# Altium schematic sheet Э4_1_New.SchDoc: Оконечное устройство
size 420 x 297 mm; ApprovedBy: Алексеев; CheckedBy: Богданов; Author: Пятиренко; DocumentNumber: АЕСН.464512.002Э4; SheetNumber: 1; SheetTotal: 2; Title2: Схема электрических соединений; PERVICH PRIM: АЕСН.464512.002; Application_BuildNumber: sdfsdfsdfsdfsdfs
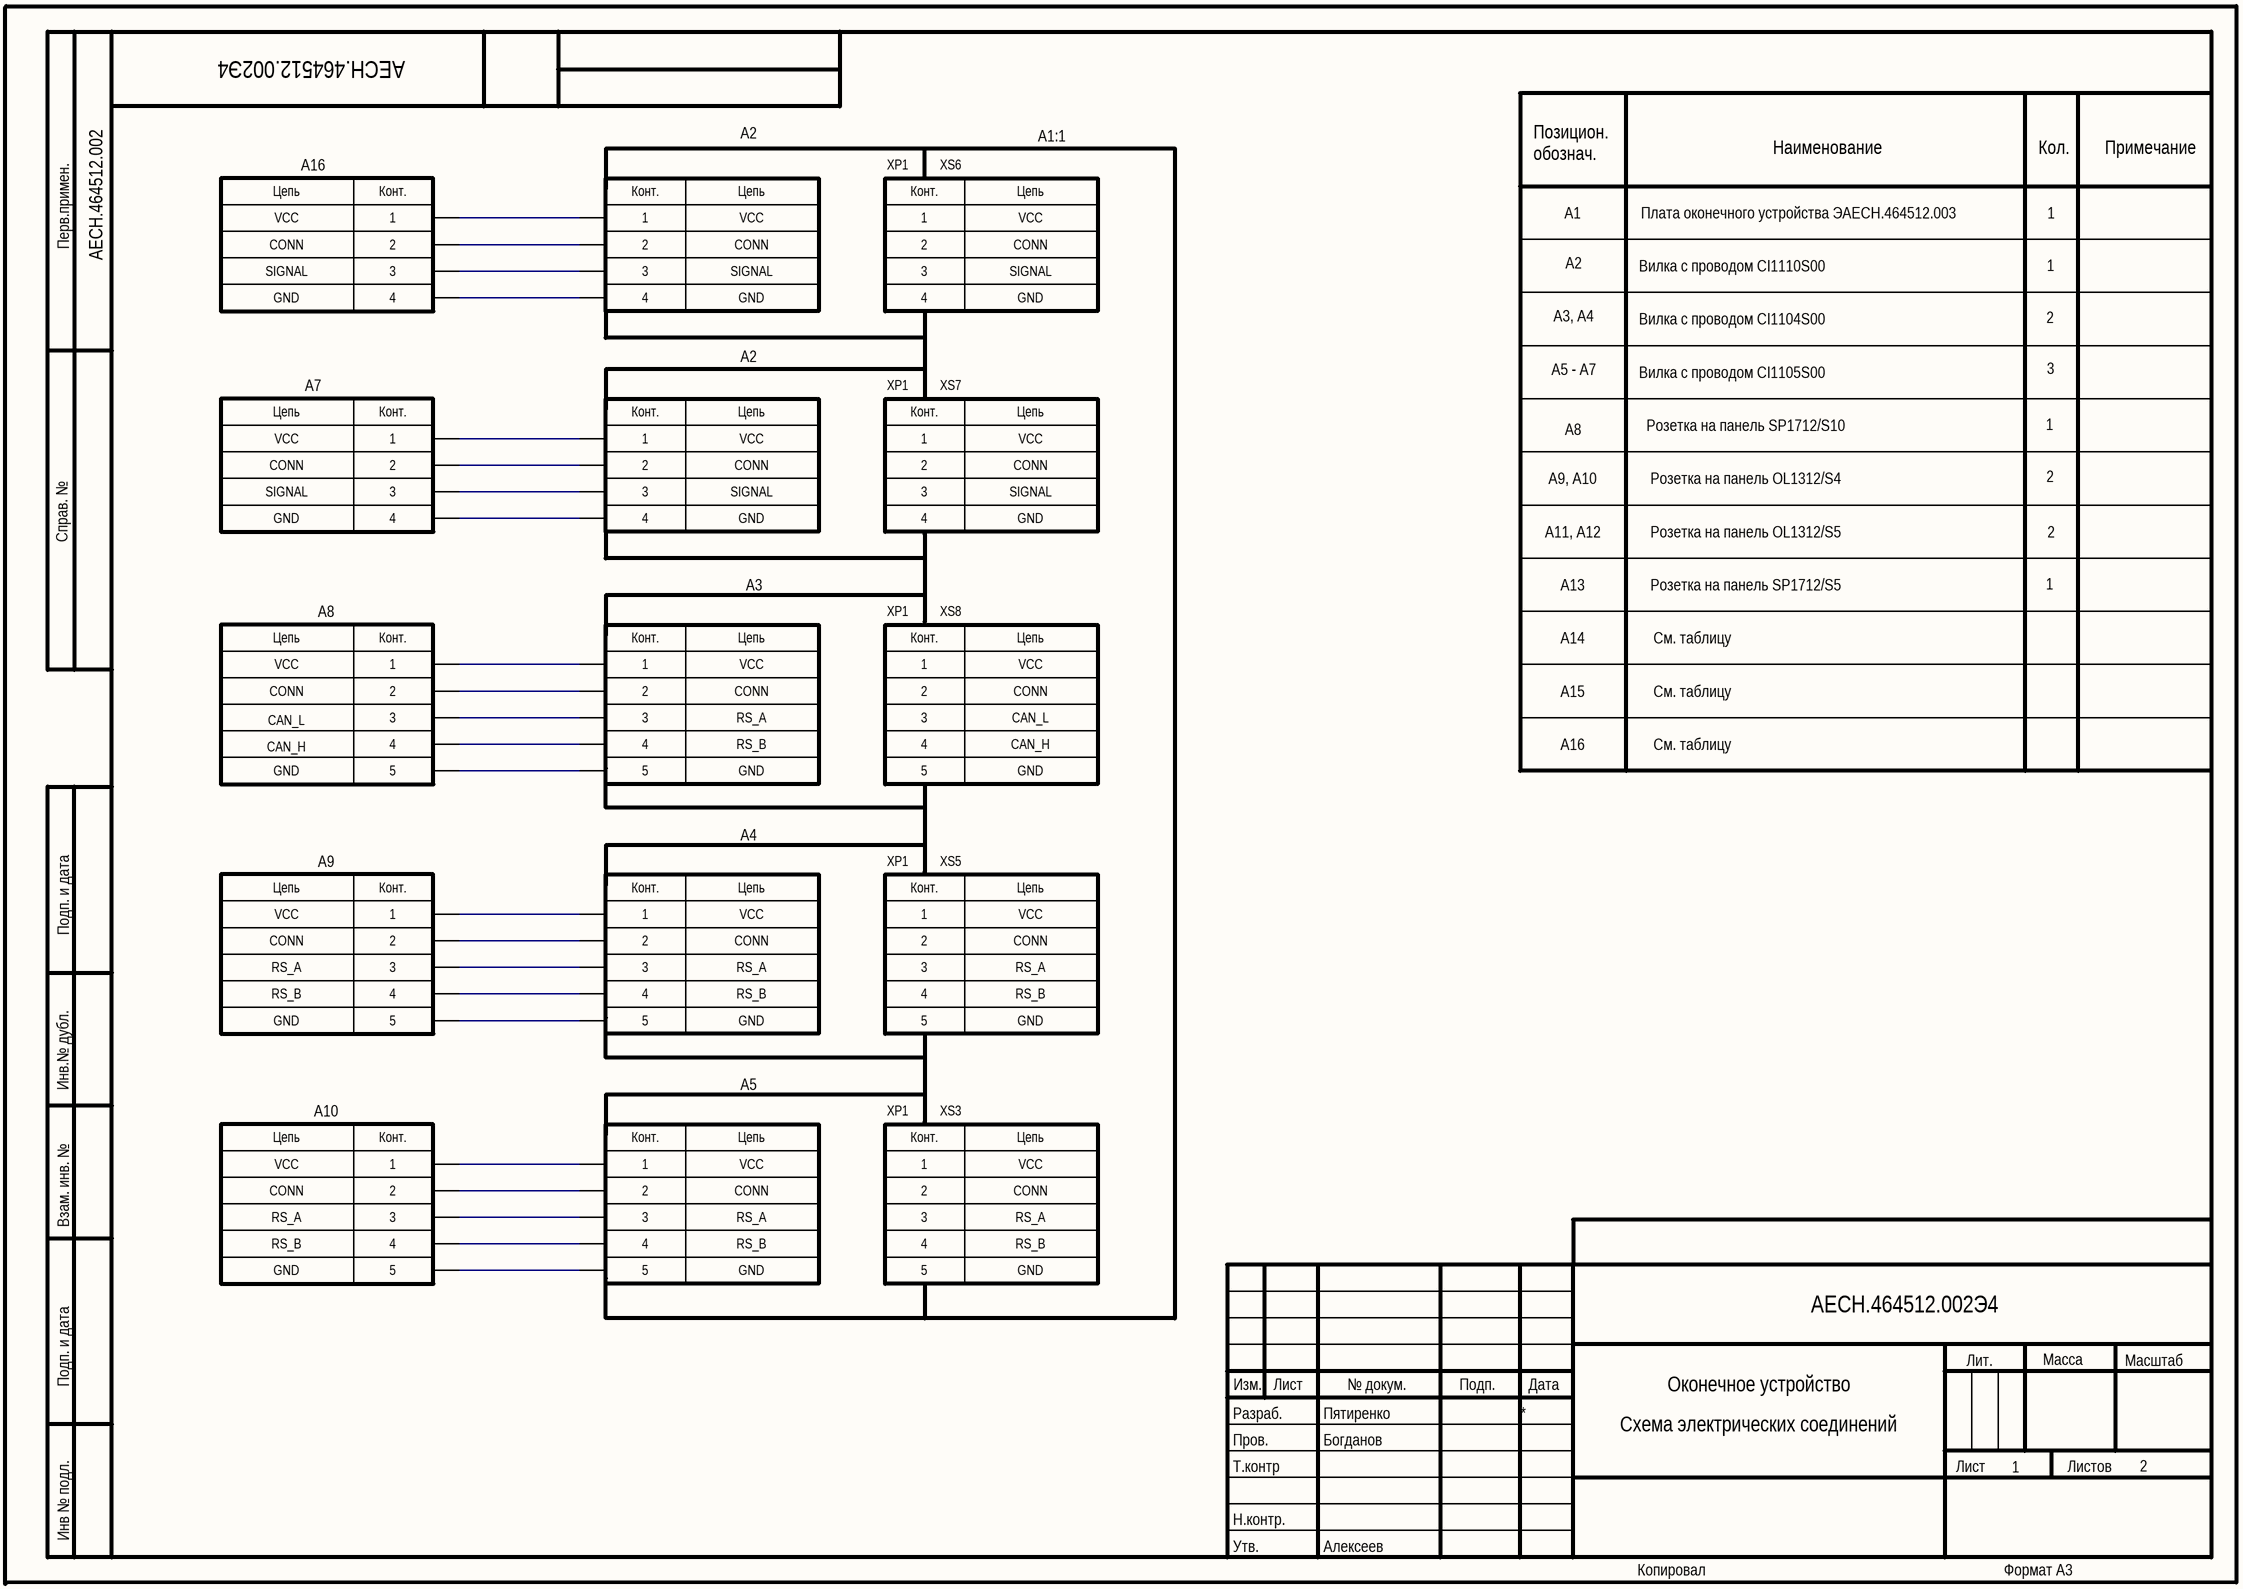
[diagram p0: Э4_1_New.SchDoc]

## Parts
(Parts that share a designator on the sheet are numbered #1, #2 ... from top to bottom, then left to right.)
X?#1  4pin  (value not drawn)
X?#2  4pin  (value not drawn)
X?#3  4pin_con  (value not drawn)
X?#4  4pin  (value not drawn)
X?#5  4pin  (value not drawn)
X?#6  4pin_con  (value not drawn)
X?#7  5pin  (value not drawn)
X?#8  5pin  (value not drawn)
X?#9  5pin_con  (value not drawn)
X?#10  5pin  (value not drawn)
X?#11  5pin  (value not drawn)
X?#12  5pin_con  (value not drawn)
X?#13  5pin  (value not drawn)
X?#14  5pin  (value not drawn)
X?#15  5pin_con  (value not drawn)

## Nets
NetX?#1_1: X?#1.1 X?#2.1
NetX?#1_2: X?#1.2 X?#2.2
NetX?#1_3: X?#1.3 X?#2.3
NetX?#1_4: X?#1.4 X?#2.4
NetX?#4_1: X?#4.1 X?#5.1
NetX?#4_2: X?#4.2 X?#5.2
NetX?#4_3: X?#4.3 X?#5.3
NetX?#4_4: X?#4.4 X?#5.4
NetX?#7_1: X?#7.1 X?#8.1
NetX?#7_2: X?#7.2 X?#8.2
NetX?#7_3: X?#7.3 X?#8.3
NetX?#7_4: X?#7.4 X?#8.4
NetX?#7_4: X?#7.4 X?#8.4  [a separate net that carries the same name]
NetX?#10_1: X?#10.1 X?#11.1
NetX?#10_2: X?#10.2 X?#11.2
NetX?#10_3: X?#10.3 X?#11.3
NetX?#10_4: X?#10.4 X?#11.4
NetX?#10_4: X?#10.4 X?#11.4  [a separate net that carries the same name]
NetX?#13_1: X?#13.1 X?#14.1
NetX?#13_2: X?#13.2 X?#14.2
NetX?#13_3: X?#13.3 X?#14.3
NetX?#13_4: X?#13.4 X?#14.4
NetX?#13_4: X?#13.4 X?#14.4  [a separate net that carries the same name]

## Notes on the sheet
- A16
- A2
- (near X?#3) XP1
- XS6
- A1:1
- Позицион.
  обознач.
- Наименование
- Кол.
- Примечание
- VCC
- CONN
- A1
- Вилка с проводом CI1110S00
- Плата оконечного устройства ЭАЕСН.464512.003
- 1
- SIGNAL
- GND
- A3, А4
- Вилка с проводом CI1104S00
- 2
- A7
- (near X?#6) XP1
- XS7
- A5 - A7
- Вилка с проводом CI1105S00
- 3
- A8
- Розетка на панель SP1712/S10
- A9, А10
- A11, А12
- Розетка на панель OL1312/S4
- Розетка на панель OL1312/S5
- A3
- A13
- Розетка на панель SP1712/S5
- (near X?#9) XP1
- XS8
- A14
- См. таблицу
- CAN_L
- RS_A
- A15
- CAN_H
- RS_B
- A9
- A4
- (near X?#12) XP1
- XS5
- A10
- A5
- (near X?#15) XP1
- XS3
- Перв.примен.
- Справ. №
- Подп. и дата
- Инв.№ дубл.
- Взам. инв. №
- Изм.
- Лист
- № докум.
- Подп.
- Дата
- Лит.
- Масса
- Масштаб
- Пров.
- Т.контр
- Разраб.
- Листов
- Инв № подл.
- Н.контр.
- Утв.
- Копировал
- Формат А3
- (in symbol 4pin) Конт.; Цепь
- (in symbol 4pin_con) Конт.; Цепь; 1; 2; 3; 4
- (in symbol 5pin) Конт.; Цепь; 5
- (in symbol 5pin_con) Конт.; Цепь; 1; 2; 3; 4; 5